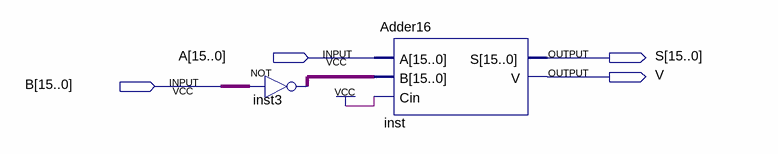
[diagram p0: schematic sheet]
// Quartus schematic Sub16a0.bdf as structural Verilog: 2 symbols, 4 pins
module Sub16a0 (
  input  [15:0] A,
  input  [15:0] B,
  output [15:0] S,
  output V
);

  wire [15:0] inst3_out;

  assign inst3_out = ~B;  // NOT inst3, 16 bits wide
  Adder16 inst (.A(A), .B(inst3_out), .Cin(1'b1), .S(S), .V(V));
endmodule
